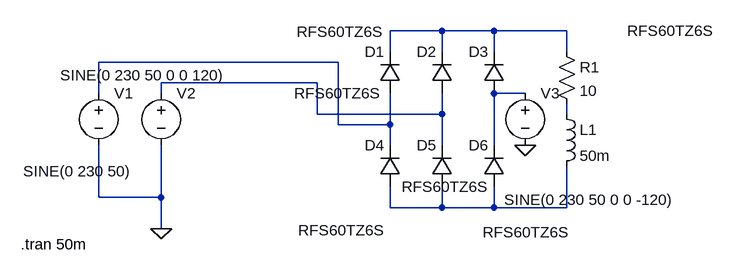
[diagram p0: schematic Section1.asc]
Section1.asc, the LTspice schematic file:
Version 4
SHEET 1 880 680
WIRE 352 96 272 96
WIRE 432 96 352 96
WIRE 544 96 432 96
WIRE 272 128 272 96
WIRE 352 128 352 96
WIRE 432 128 432 96
WIRE 544 128 544 96
WIRE 192 144 -176 144
WIRE 160 176 -80 176
WIRE -176 192 -176 144
WIRE -80 192 -80 176
WIRE 480 192 432 192
WIRE 160 224 160 176
WIRE 352 224 352 192
WIRE 352 224 160 224
WIRE 544 224 544 208
WIRE 192 240 192 144
WIRE 272 240 272 192
WIRE 272 240 192 240
WIRE 272 272 272 240
WIRE 352 272 352 224
WIRE 432 272 432 192
WIRE -176 352 -176 272
WIRE -80 352 -80 272
WIRE -80 352 -176 352
WIRE 272 368 272 336
WIRE 352 368 352 336
WIRE 352 368 272 368
WIRE 432 368 432 336
WIRE 432 368 352 368
WIRE 544 368 544 304
WIRE 544 368 432 368
WIRE -80 400 -80 352
FLAG -80 400 0
FLAG 480 272 0
SYMBOL voltage -176 176 R0
WINDOW 3 -116 136 Left 2
WINDOW 123 0 0 Left 0
WINDOW 39 0 0 Left 0
SYMATTR Value SINE(0 230 50)
SYMATTR InstName V1
SYMBOL voltage -80 176 R0
WINDOW 3 -155 -12 Left 2
WINDOW 123 0 0 Left 0
WINDOW 39 0 0 Left 0
SYMATTR Value SINE(0 230 50 0 0 120)
SYMATTR InstName V2
SYMBOL voltage 480 176 R0
WINDOW 3 -32 180 Left 2
WINDOW 123 0 0 Left 0
WINDOW 39 0 0 Left 0
SYMATTR Value SINE(0 230 50 0 0 -120)
SYMATTR InstName V3
SYMBOL diode 288 192 R180
WINDOW 0 24 64 Left 2
WINDOW 3 29 0 Left 2
SYMATTR InstName D1
SYMATTR Value RFS60TZ6S
SYMBOL diode 368 192 R180
WINDOW 0 24 64 Left 2
WINDOW 3 105 95 Left 2
SYMATTR InstName D2
SYMATTR Value RFS60TZ6S
SYMBOL diode 448 192 R180
WINDOW 0 24 64 Left 2
WINDOW 3 -323 96 Left 2
SYMATTR InstName D3
SYMATTR Value RFS60TZ6S
SYMBOL res 528 112 R0
SYMATTR InstName R1
SYMATTR Value 10
SYMBOL ind 528 208 R0
SYMATTR InstName L1
SYMATTR Value 50m
SYMBOL diode 288 336 R180
WINDOW 0 24 64 Left 2
WINDOW 3 23 -67 Left 2
SYMATTR InstName D4
SYMATTR Value RFS60TZ6S
SYMBOL diode 368 336 R180
WINDOW 0 24 64 Left 2
WINDOW 3 -181 -70 Left 2
SYMATTR InstName D5
SYMATTR Value RFS60TZ6S
SYMBOL diode 448 336 R180
WINDOW 0 24 64 Left 2
WINDOW 3 24 0 Left 2
SYMATTR InstName D6
SYMATTR Value RFS60TZ6S
TEXT -296 424 Left 2 !.tran 50m

The netlist it stands for:
* Section1.asc
V1 N002 0 SINE(0 230 50)
V2 N003 0 SINE(0 230 50 0 0 120)
V3 N004 0 SINE(0 230 50 0 0 -120)
D1 N002 N001 RFS60TZ6S
D2 N003 N001 RFS60TZ6S
D3 N004 N001 RFS60TZ6S
R1 N001 N005 10
L1 N005 N006 50m
D4 N006 N002 RFS60TZ6S
D5 N006 N003 RFS60TZ6S
D6 N006 N004 RFS60TZ6S
.model D D
.lib standard.dio
.tran 50m
.backanno
.end